# Altium schematic sheet ICL7660.schdoc
size 55 x 37 mm
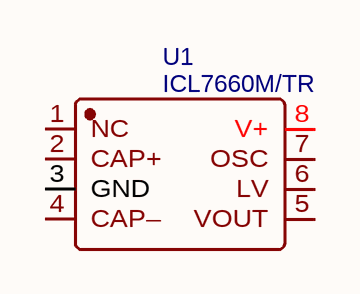
[diagram p0: ICL7660.schdoc]

## Parts
U1  ICL7660M/TR  [SOP-8_L4.9-W3.9-P1.27-LS6.0-BL]

## Nets

Not connected (* = marked no-connect by the designer): U1 1(NC) 2(CAP+) 3(GND) 4(CAP–) 5(VOUT) 6(LV) 7(OSC) 8(V+)

## Library data of the parts
U1 = ICL7660M/TR: BOM_Manufacturer: HGSEMI; Contributor: LCSC; BOM_Supplier: LCSC; BOM_Supplier Part: C356724; BOM_Manufacturer Part: ICL7660M/TR; BOM_JLCPCB Part Class: Extended Part; spicePre: U; spiceSymbolName: ICL7660M/TR